# EAGLE design Flyfocus_Bird_CANdy_V1.0 (EAGLE 9.6.2)

## Sheet 1 of 3: Microcontroller
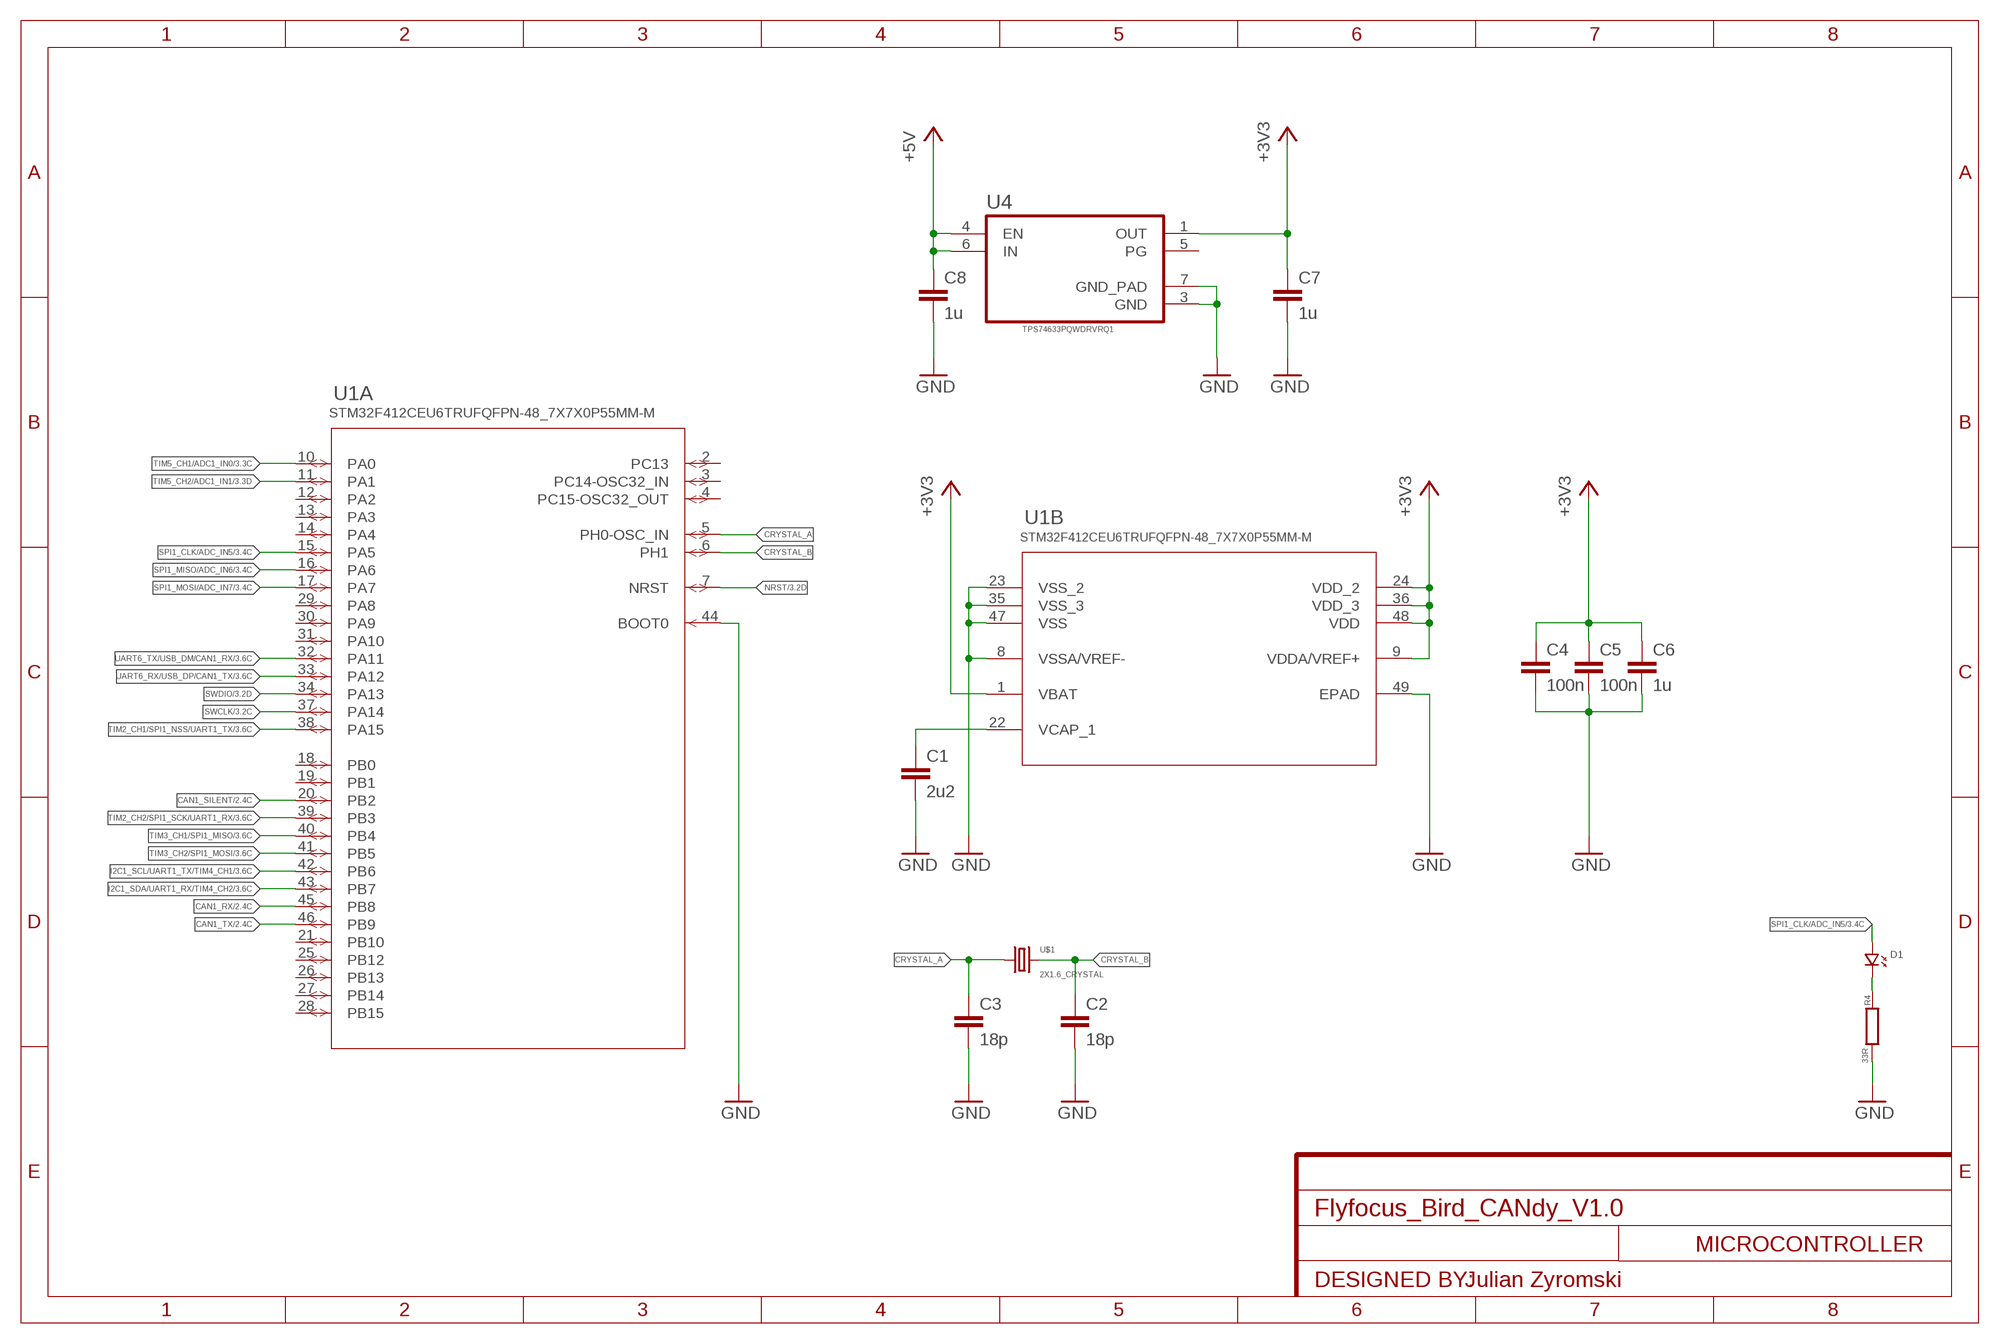
[diagram p0: schematic, sheet 1]

### Parts
C1  2u2  C-EUC0402_RESISTOR_FOOTPRINT  [R0402]
C2  18p  C-EUC0402_RESISTOR_FOOTPRINT  [R0402]
C3  18p  C-EUC0402_RESISTOR_FOOTPRINT  [R0402]
C4  100n  C-EUC0402_RESISTOR_FOOTPRINT  [R0402]
C5  100n  C-EUC0402_RESISTOR_FOOTPRINT  [R0402]
C6  1u  C-EUC0402_RESISTOR_FOOTPRINT  [R0402]
C7  1u  C-EUC0402_RESISTOR_FOOTPRINT  [R0402]
C8  1u  C-EUC0402_RESISTOR_FOOTPRINT  [R0402]
D1  LED.0402  [0402.LED]
R4  33R  R-EU_R0402  [R0402]
U1  STM32F412CEU6TRUFQFPN-48_7X7X0P55MM-M  [UFQFPN-48_7X7X0P55MM-M]
U4  TPS74633PQWDRVRQ1  [SON65P200X200X80-7N]
U$1  2X1.6_CRYSTAL  [OSC_FA-128_16MHZ]

### Nets
+3V3: C4.1 C5.1 C6.1 C7.1 U1.1(B:VBAT) U1.9(B:VDDA/VREF+) U1.24(B:VDD_2) U1.36(B:VDD_3) U1.48(B:VDD) U4.1(OUT) ; also sheet 2,3
+5V: C8.1 U4.4(EN) U4.6(IN) ; also sheet 2,3
CAN1_RX: U1.45(A:PB8) ; also sheet 2
CAN1_SILENT: U1.20(A:PB2) ; also sheet 2
CAN1_TX: U1.46(A:PB9) ; also sheet 2
CRYSTAL_A: C3.1 U1.5(A:PH0-OSC_IN) U$1.1
CRYSTAL_B: C2.1 U1.6(A:PH1) U$1.3
GND: C1.2 C2.2 C3.2 C4.2 C5.2 C6.2 C7.2 C8.2 R4.2 U1.8(B:VSSA/VREF-) U1.23(B:VSS_2) U1.35(B:VSS_3) U1.44(A:BOOT0) U1.47(B:VSS) U1.49(B:EPAD) U4.3(GND) U4.7(GND_PAD) ; also sheet 2,3
I2C1_SCL/UART1_TX/TIM4_CH1: U1.42(A:PB6) ; also sheet 3
I2C1_SDA/UART1_RX/TIM4_CH2: U1.43(A:PB7) ; also sheet 3
N$1: C1.1 U1.22(B:VCAP_1)
N$4: D1.P$2 R4.1
NRST: U1.7(A:NRST) ; also sheet 3
SPI1_CLK/ADC_IN5: D1.P$1 U1.15(A:PA5) ; also sheet 3
SPI1_MISO/ADC_IN6: U1.16(A:PA6) ; also sheet 3
SPI1_MOSI/ADC_IN7: U1.17(A:PA7) ; also sheet 3
SWCLK: U1.37(A:PA14) ; also sheet 3
SWDIO: U1.34(A:PA13) ; also sheet 3
TIM2_CH1/SPI1_NSS/UART1_TX: U1.38(A:PA15) ; also sheet 3
TIM2_CH2/SPI1_SCK/UART1_RX: U1.39(A:PB3) ; also sheet 3
TIM3_CH1/SPI1_MISO: U1.40(A:PB4) ; also sheet 3
TIM3_CH2/SPI1_MOSI: U1.41(A:PB5) ; also sheet 3
TIM5_CH1/ADC1_IN0: U1.10(A:PA0) ; also sheet 3
TIM5_CH2/ADC1_IN1: U1.11(A:PA1) ; also sheet 3
UART6_RX/USB_DP/CAN1_TX: U1.33(A:PA12) ; also sheet 3
UART6_TX/USB_DM/CAN1_RX: U1.32(A:PA11) ; also sheet 3
Unconnected: U1.2(A:PC13) U1.3(A:PC14-OSC32_IN) U1.4(A:PC15-OSC32_OUT) U1.12(A:PA2) U1.13(A:PA3) U1.14(A:PA4) U1.18(A:PB0) U1.19(A:PB1) U1.21(A:PB10) U1.25(A:PB12) U1.26(A:PB13) U1.27(A:PB14) U1.28(A:PB15) U1.29(A:PA8) U1.30(A:PA9) U1.31(A:PA10) U4.5(PG)

### Notes on the sheet
- MICROCONTROLLER
- Julian Zyromski

## Sheet 2 of 3: CAN Interface
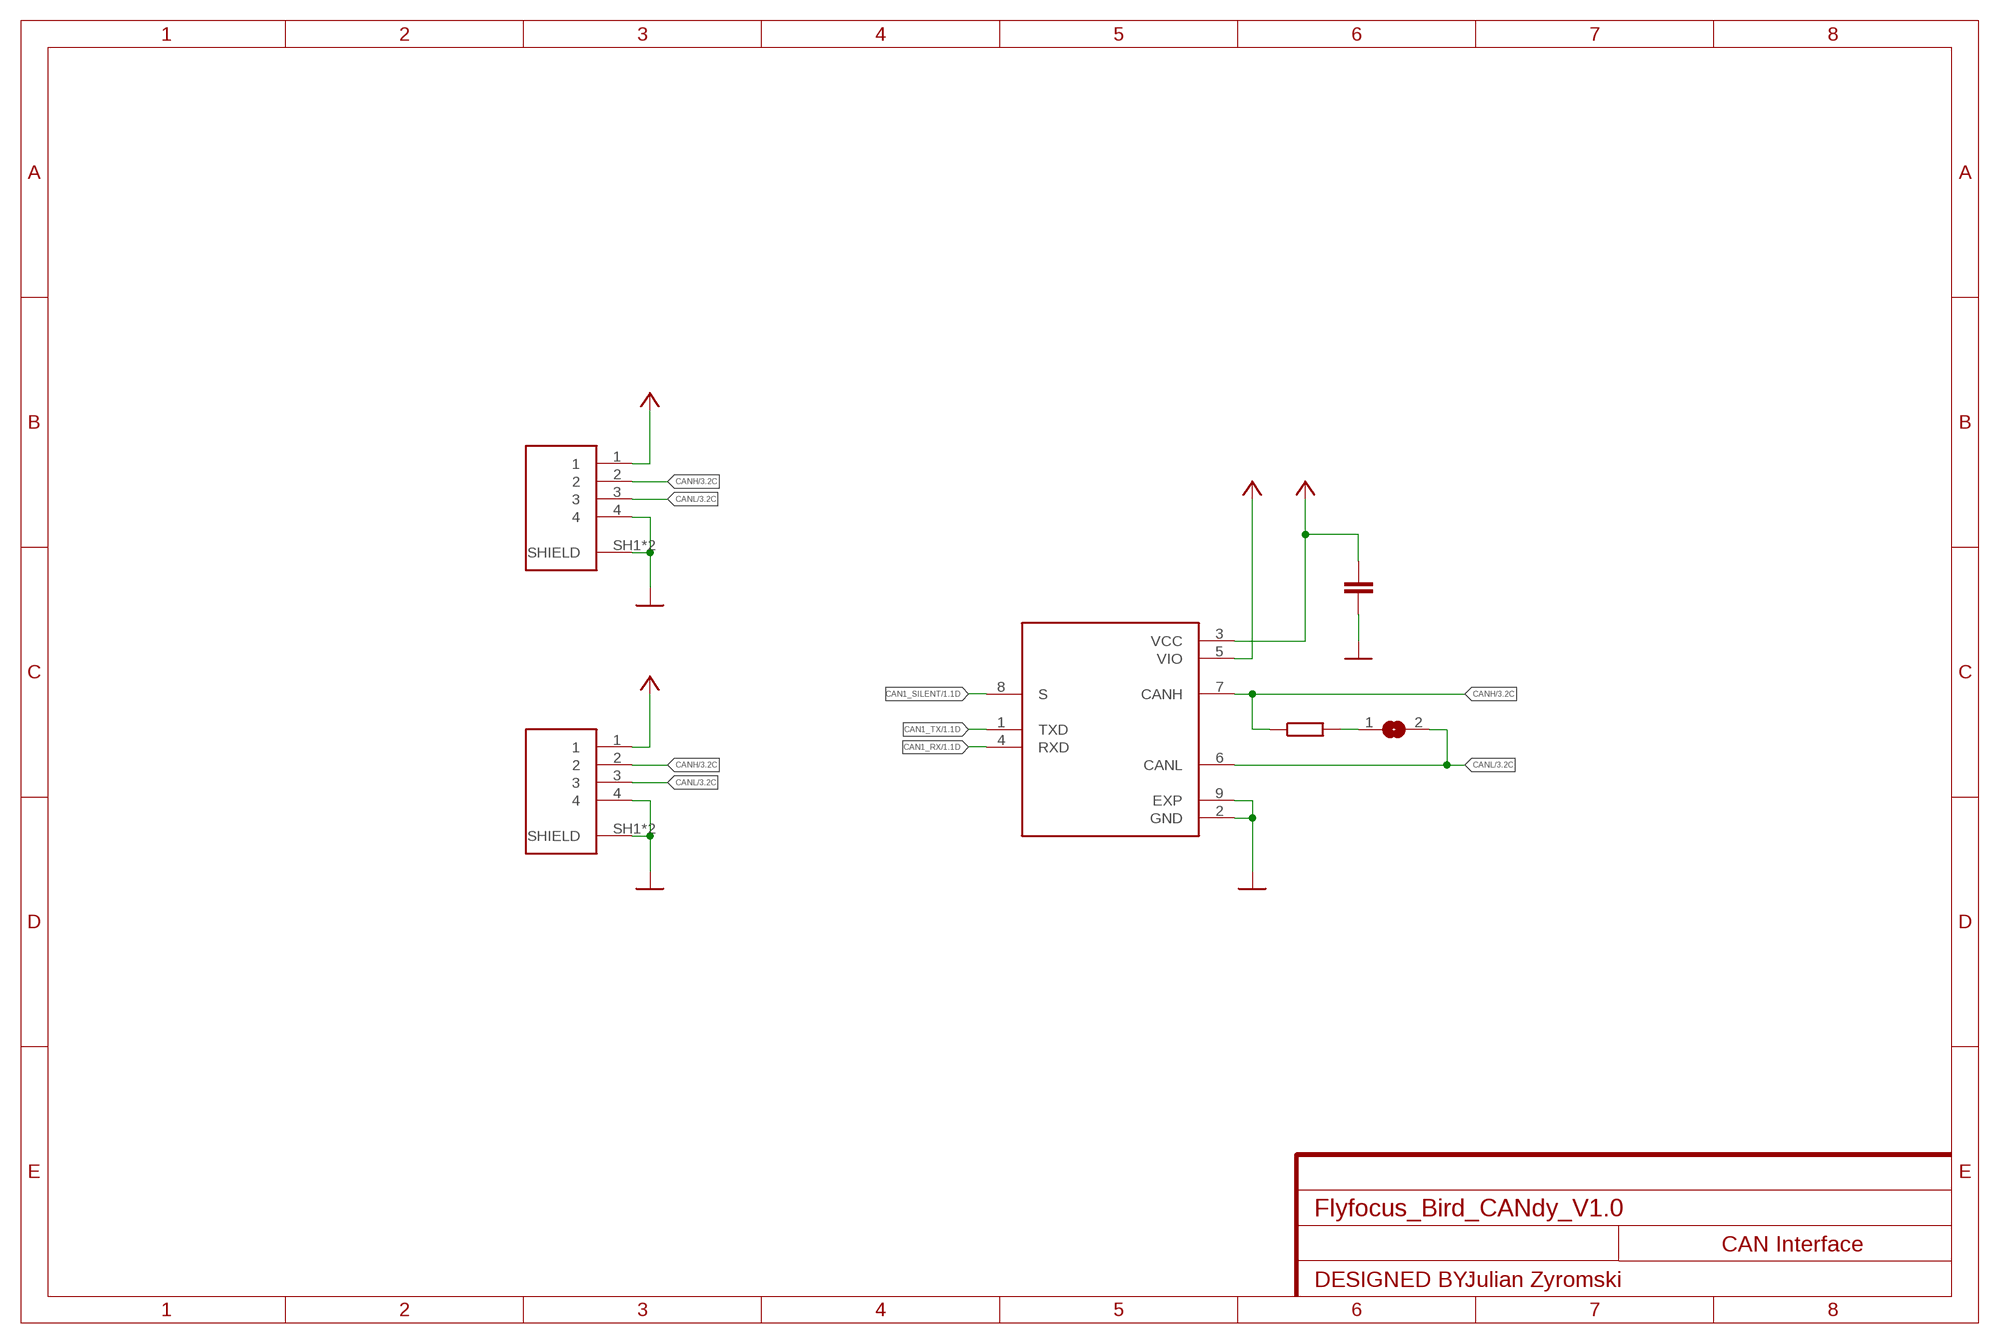
[diagram p1: schematic, sheet 2]

### Parts
C9  2u2  C-EUC0402_RESISTOR_FOOTPRINT  [R0402]
J1  SM04B-GHS-TB(LF)(SN)-  [JST_SM04B-GHS-TB(LF)(SN)-]
J2  SM04B-GHS-TB(LF)(SN)-  [JST_SM04B-GHS-TB(LF)(SN)-]
R1  120R/thick_film  R0603  [0603]
SJ1  SJ  [SJ]
U2  TJA1051TK/3/1J  [SON65P300X300X95-8N]

### Nets
+3V3: U2.5(VIO) ; also sheet 1,3
+5V: C9.1 J1.1 J2.1 U2.3(VCC) ; also sheet 1,3
CAN1_RX: U2.4(RXD) ; also sheet 1
CAN1_SILENT: U2.8(S) ; also sheet 1
CAN1_TX: U2.1(TXD) ; also sheet 1
CANH: J1.2 J2.2 R1.P$1 U2.7(CANH) ; also sheet 3
CANL: J1.3 J2.3 SJ1.2 U2.6(CANL) ; also sheet 3
GND: C9.2 J1.4 J1.SH1(SHIELD) J1.SH2(SHIELD) J2.4 J2.SH1(SHIELD) J2.SH2(SHIELD) U2.2(GND) U2.9(EXP) ; also sheet 1,3
N$3: R1.P$2 SJ1.1

### Notes on the sheet
- CAN Interface
- Julian Zyromski

## Sheet 3 of 3: GPIO
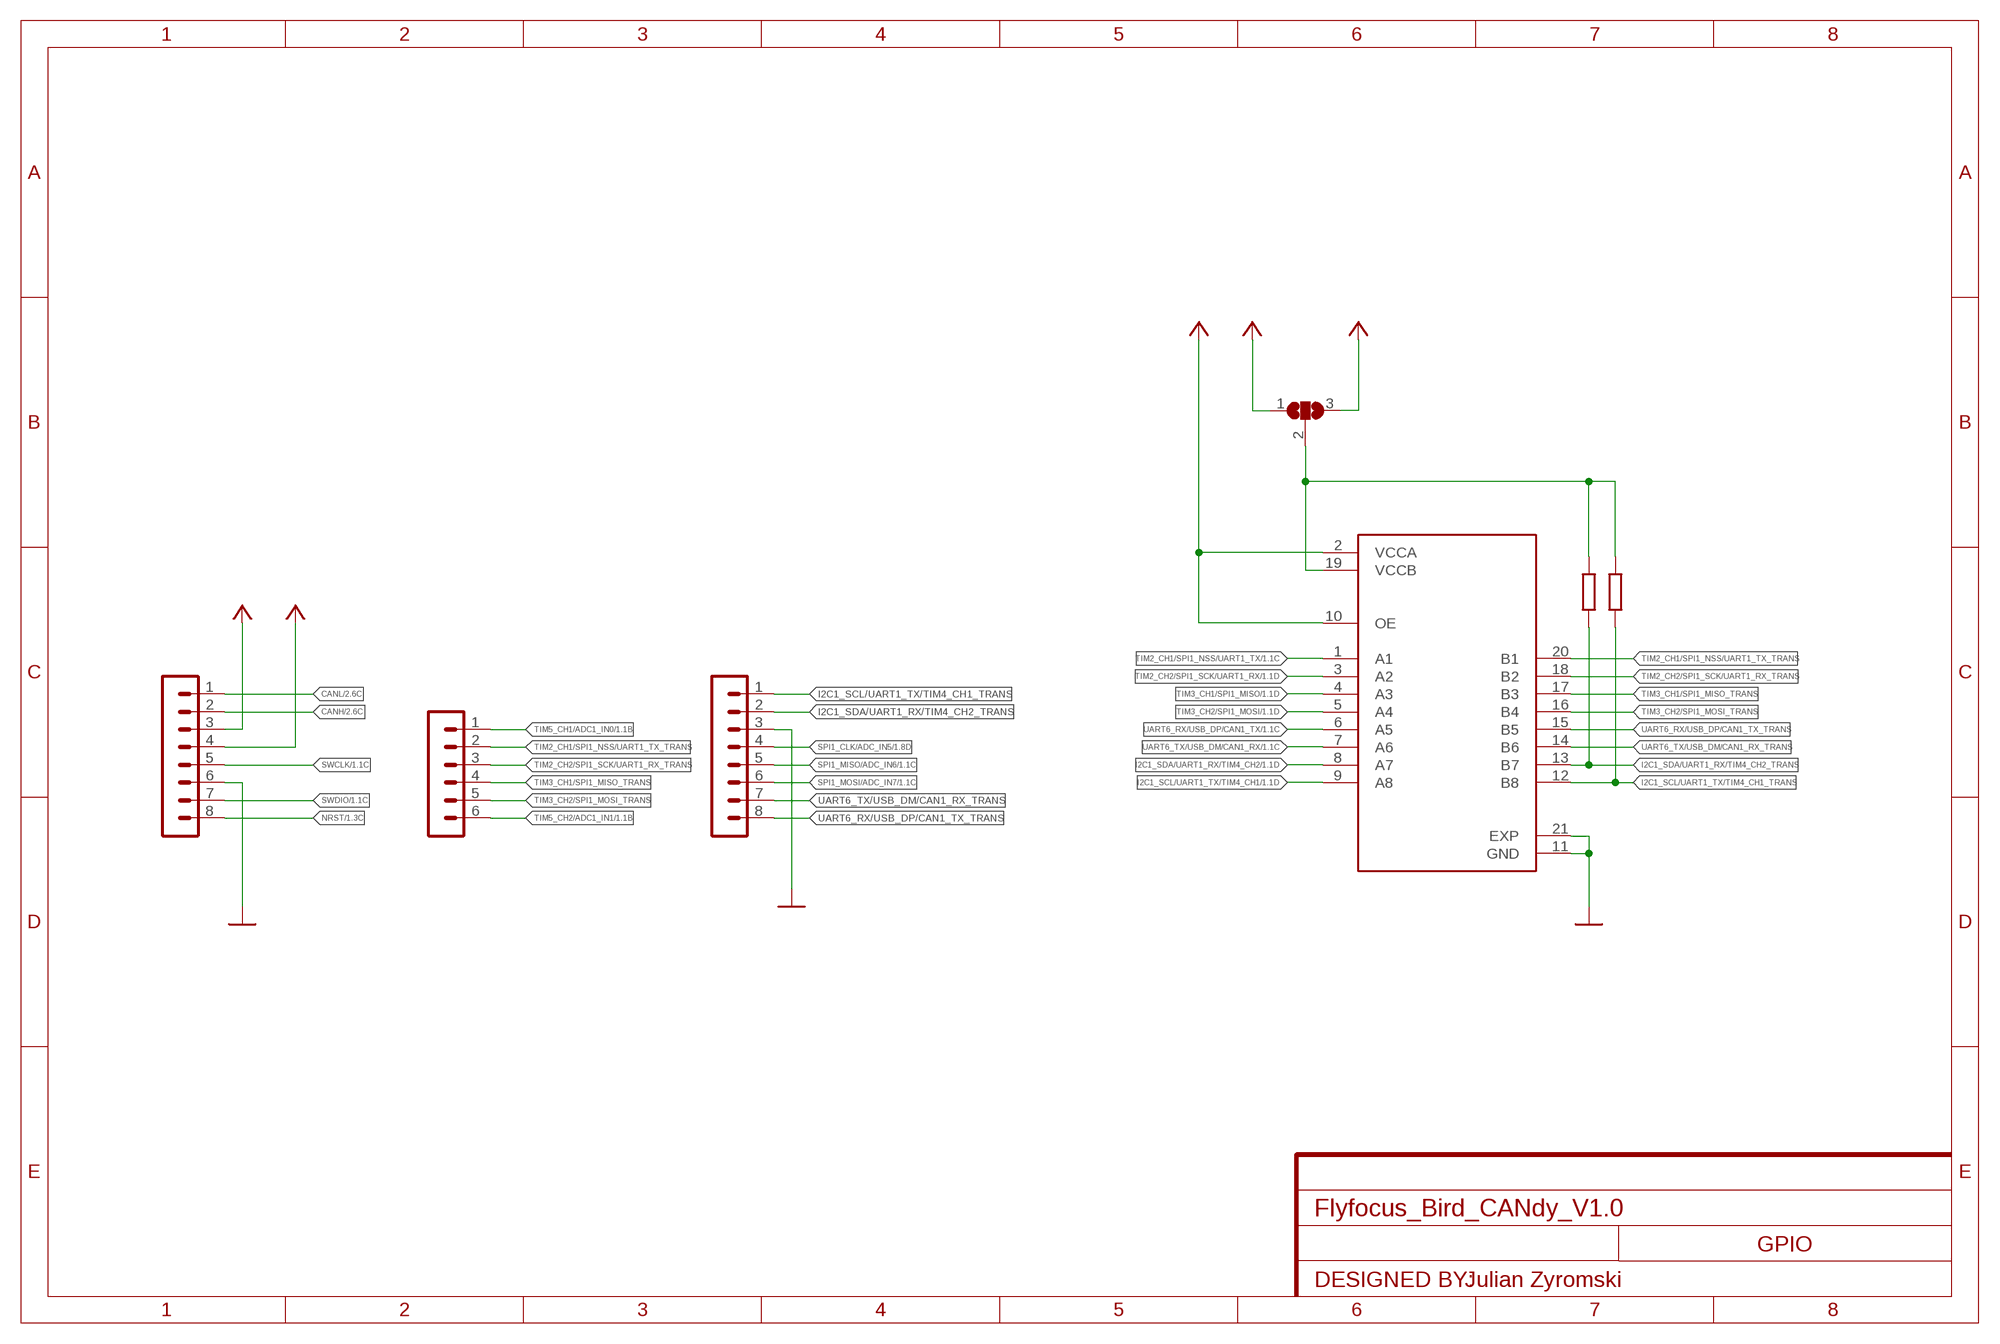
[diagram p2: schematic, sheet 3]

### Parts
R2  4k7  R-EU_R0402  [R0402]
R3  4k7  R-EU_R0402  [R0402]
SJ2  SJ2W  [SJ_2]
SV1  MA08-1  [MA08-1]
SV2  MA08-1  [MA08-1]
SV3  MA06-1  [MA06-1]
U3  TXS0108ERGYR  [IC_TXS0108ERGYR]

### Nets
+3V3: SJ2.1 SV1.4 U3.2(VCCA) U3.10(OE) ; also sheet 1,2
+5V: SJ2.3 SV1.3 ; also sheet 1,2
CANH: SV1.2 ; also sheet 2
CANL: SV1.1 ; also sheet 2
GND: SV1.6 SV2.3 U3.11(GND) U3.21(EXP) ; also sheet 1,2
I2C1_SCL/UART1_TX/TIM4_CH1: U3.9(A8) ; also sheet 1
I2C1_SCL/UART1_TX/TIM4_CH1_TRANS: R3.1 SV2.1 U3.12(B8)
I2C1_SDA/UART1_RX/TIM4_CH2: U3.8(A7) ; also sheet 1
I2C1_SDA/UART1_RX/TIM4_CH2_TRANS: R2.1 SV2.2 U3.13(B7)
N$2: R2.2 R3.2 SJ2.2 U3.19(VCCB)
NRST: SV1.8 ; also sheet 1
SPI1_CLK/ADC_IN5: SV2.4 ; also sheet 1
SPI1_MISO/ADC_IN6: SV2.5 ; also sheet 1
SPI1_MOSI/ADC_IN7: SV2.6 ; also sheet 1
SWCLK: SV1.5 ; also sheet 1
SWDIO: SV1.7 ; also sheet 1
TIM2_CH1/SPI1_NSS/UART1_TX: U3.1(A1) ; also sheet 1
TIM2_CH1/SPI1_NSS/UART1_TX_TRANS: SV3.2 U3.20(B1)
TIM2_CH2/SPI1_SCK/UART1_RX: U3.3(A2) ; also sheet 1
TIM2_CH2/SPI1_SCK/UART1_RX_TRANS: SV3.3 U3.18(B2)
TIM3_CH1/SPI1_MISO: U3.4(A3) ; also sheet 1
TIM3_CH1/SPI1_MISO_TRANS: SV3.4 U3.17(B3)
TIM3_CH2/SPI1_MOSI: U3.5(A4) ; also sheet 1
TIM3_CH2/SPI1_MOSI_TRANS: SV3.5 U3.16(B4)
TIM5_CH1/ADC1_IN0: SV3.1 ; also sheet 1
TIM5_CH2/ADC1_IN1: SV3.6 ; also sheet 1
UART6_RX/USB_DP/CAN1_TX: U3.6(A5) ; also sheet 1
UART6_RX/USB_DP/CAN1_TX_TRANS: SV2.8 U3.15(B5)
UART6_TX/USB_DM/CAN1_RX: U3.7(A6) ; also sheet 1
UART6_TX/USB_DM/CAN1_RX_TRANS: SV2.7 U3.14(B6)

### Notes on the sheet
- GPIO
- Julian Zyromski

## Library data of the parts
C1-C9 = rcl_julian:C-EU: CAPACITOR, European symbol
D1 = standardparts:LED
J1 J2 = SM04B-GHS-TB_LF__SN_-:SM04B-GHS-TB(LF)(SN)-: Conn Header Gh Side 4pos 1.25mm; AVAILABILITY: Unavailable; DESCRIPTION: Conn Header Gh Side 4pos 1.25mm; MF: JST Sales; MP: SM04B-GHS-TB_LF__SN_-; PACKAGE: None; PRICE: None
R1 = sapog_reference_hardware:R
R2-R4 = rcl_julian:R-EU_: RESISTOR, European symbol; SPICEPREFIX: R
SJ1 = jumper:SJ: SMD solder JUMPER
SJ2 = jumper:SJ2W: SMD solder JUMPER
SV1 SV2 = con-lstb:MA08-1: PIN HEADER; OC_FARNELL: unknown; OC_NEWARK: unknown
SV3 = con-lstb:MA06-1: PIN HEADER; OC_FARNELL: unknown; OC_NEWARK: unknown
U1 = STM32F412CEU6:STM32F412CEU6TR; BUILT_BY: EMA_UL_Team; COPYRIGHT: Copyright (C) 2018 Accelerated Designs. All rights reserved; MANUFACTURER_PART_NUMBER: STM32F412CEU6TR; SOURCELIBRARY: STMicroelectronics_2020-10-07; VENDOR: STMicroelectronics
U2 = TJA1051TK_3_1J:TJA1051TK/3/1J: TJA1051 Single 5 V 1 MBd Surface Mount High Speed CAN Transceiver - HVSON-8; AVAILABILITY: Unavailable; DESCRIPTION: TJA1051 Single 5 V 1 MBd Surface Mount High Speed CAN Transceiver - HVSON-8; MF: NXP USA; MP: TJA1051TK/3/1J; PACKAGE: VDFN-8 NXP Semiconductors; PRICE: None
U3 = TXS0108ERGYR:TXS0108ERGYR: 8-bit bidirectional voltage-level shifter for open-drain and push-pull application 20-VQFN -40 to 85 Check prices <https://pricing.snapeda.com/search/part/TXS0108ERGYR/?ref=eda>; AVAILABILITY: Good; DESCRIPTION: 8-bit bidirectional voltage-level shifter for open-drain and push-pull application 20-VQFN -40 to 85; MF: Texas Instruments; MP: TXS0108ERGYR; PACKAGE: VQFN-20 Texas Instruments; PRICE: None; PURCHASE-URL: https://pricing.snapeda.com/search/part/TXS0108ERGYR/?ref=eda
U4 = TPS74633PQWDRVRQ1:TPS74633PQWDRVRQ1: None Check prices <https://pricing.snapeda.com/parts/TPS74633PQWDRVRQ1/Texas%20Instruments/view-part?ref=eda>; AVAILABILITY: Warning; DESCRIPTION: Automotive 1-A, low-IQ, high-PSRR, low-dropout (LDO) voltage regulator with power good 6-WSON -40 to 125; MF: Texas Instruments; MP: TPS74633PQWDRVRQ1; PACKAGE: WSON-6 Texas Instruments; PRICE: None; PURCHASE-URL: https://pricing.snapeda.com/search/part/TPS74633PQWDRVRQ1/?ref=eda
U$1 = OSC_FA-128_16MHz:2X1.6_CRYSTAL

## Board
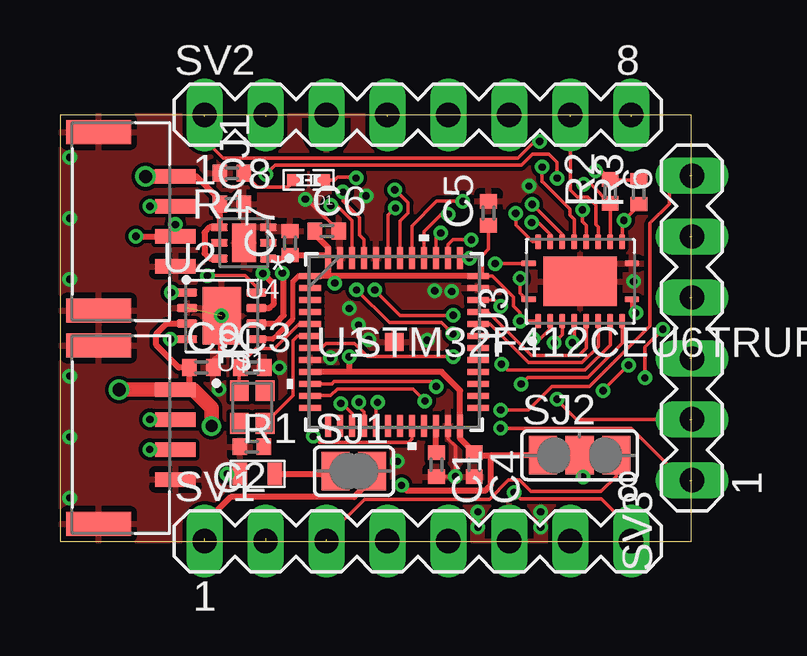
[diagram p3: board, top side]
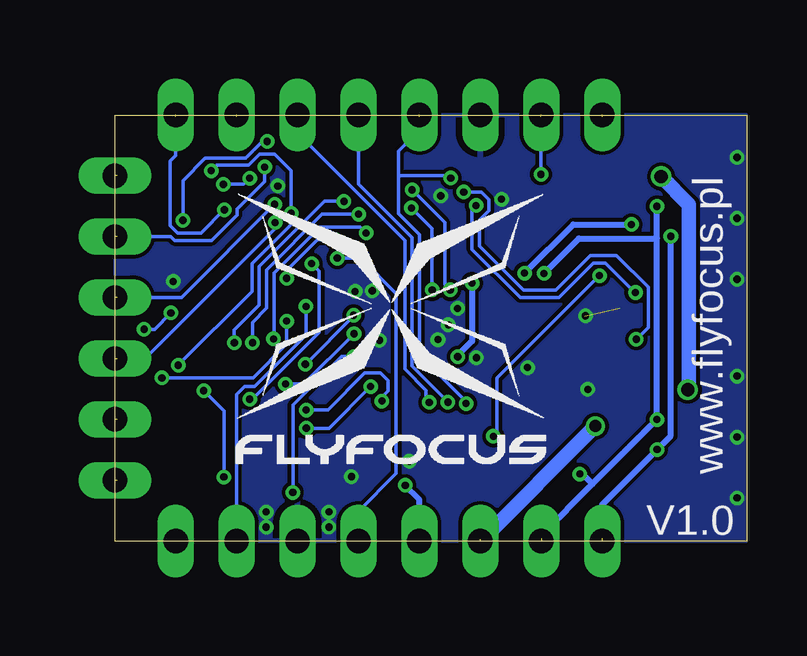
[diagram p4: board, bottom side, seen from below]

Size 26.33 x 17.77 mm. Coordinates in mm from the lower left corner, seen from the top.
Outline: 0,0 26.33,0 26.33,17.77 0,17.77 0,0
Copper layers (1*16): Top 0.035mm / dielectric 0.8mm / Bottom 0.035mm
Design rules "default *": minimum track width 6mil, minimum drill 0.3mm, track to track 6mil, track to pad 6mil, pad to pad 6mil, via to via 6mil, smd to smd 6mil, copper to edge 0mil, drill to drill 6mil, minimum pad ring 6mil, minimum via ring 6mil, stop-mask expansion 4mil, vias tented up to drill 40mil, thermal gap 10mil

### Footprints (pad centres in the part's own frame; a part is rotated, then mirrored left to right if it is on the bottom)
R0402 = smd 0.6 x 0.7: 1 -0.5,0; 2 0.5,0
0402.LED = smd 0.7 x 0.5: P$1 -0.55,0; P$2 0.55,0
JST_SM04B-GHS-TB(LF)(SN)- = smd 0.6 x 1.7: 1 -1.875,2.275; 2 -0.625,2.275; 3 0.625,2.275; 4 1.875,2.275 | smd 1 x 2.7: SH1 -3.725,-0.925; SH2 3.725,-0.925
0603 = smd 0.6 x 0.9: P$1 -0.725,0; P$2 0.725,0
SJ = smd 1.168 x 1.6: 1 -0.762,0; 2 0.762,0
SJ_2 = smd 1.168 x 1.6: 1 -1.524,0; 2 0,0; 3 1.524,0
MA08-1 = drill 1.016 long: 1 -8.89,0; 2 -6.35,0; 3 -3.81,0; 4 -1.27,0; 5 1.27,0; 6 3.81,0; 7 6.35,0; 8 8.89,0
MA06-1 = drill 1.016 long: 1 -6.35,0; 2 -3.81,0; 3 -1.27,0; 4 1.27,0; 5 3.81,0; 6 6.35,0
UFQFPN-48_7X7X0P55MM-M = smd 0.914 x 0.254: 1 -3.505,2.75; 2 -3.505,2.25; 3 -3.505,1.75; 4 -3.505,1.25; 5 -3.505,0.75; 6 -3.505,0.25; 7 -3.505,-0.25; 8 -3.505,-0.75; 9 -3.505,-1.25; 10 -3.505,-1.75; 11 -3.505,-2.25; 12 -3.505,-2.75; 25 3.505,-2.75; 26 3.505,-2.25; 27 3.505,-1.75; 28 3.505,-1.25; 29 3.505,-0.75; 30 3.505,-0.25; 31 3.505,0.25; 32 3.505,0.75; 33 3.505,1.25; 34 3.505,1.75; 35 3.505,2.25; 36 3.505,2.75 | smd 0.254 x 0.914: 13 -2.75,-3.505; 14 -2.25,-3.505; 15 -1.75,-3.505; 16 -1.25,-3.505; 17 -0.75,-3.505; 18 -0.25,-3.505; 19 0.25,-3.505; 20 0.75,-3.505; 21 1.25,-3.505; 22 1.75,-3.505; 23 2.25,-3.505; 24 2.75,-3.505; 37 2.75,3.505; 38 2.25,3.505; 39 1.75,3.505; 40 1.25,3.505; 41 0.75,3.505; 42 0.25,3.505; 43 -0.25,3.505; 44 -0.75,3.505; 45 -1.25,3.505; 46 -1.75,3.505; 47 -2.25,3.505; 48 -2.75,3.505 | smd 0.762 x 0.762: 49 0,0
SON65P300X300X95-8N = smd 0.84 x 0.32: 1 -1.445,0.975; 2 -1.445,0.325; 3 -1.445,-0.325; 4 -1.445,-0.975; 5 1.445,-0.975; 6 1.445,-0.325; 7 1.445,0.325; 8 1.445,0.975 | smd 1.6 x 2.4: 9 0,0
IC_TXS0108ERGYR = smd 0.24 x 0.6: 1 -0.75,2.15; 10 -0.75,-2.15; 11 0.75,-2.15; 20 0.75,2.15 | smd 0.6 x 0.24: 2 -1.65,1.75; 3 -1.65,1.25; 4 -1.65,0.75; 5 -1.65,0.25; 6 -1.65,-0.25; 7 -1.65,-0.75; 8 -1.65,-1.25; 9 -1.65,-1.75; 12 1.65,-1.75; 13 1.65,-1.25; 14 1.65,-0.75; 15 1.65,-0.25; 16 1.65,0.25; 17 1.65,0.75; 18 1.65,1.25; 19 1.65,1.75 | smd 2.05 x 3.05: 21 0,0
SON65P200X200X80-7N = smd 0.69 x 0.32: 1 -1.02,0.65; 2 -1.02,0; 3 -1.02,-0.65; 4 1.02,-0.65; 5 1.02,0; 6 1.02,0.65 | smd 1 x 1.6: 7 0,0
OSC_FA-128_16MHZ = smd 0.774 x 0.874: 1 -0.537,0.687; 2 -0.537,-0.687; 3 0.537,-0.687; 4 0.537,0.687

### Placement (x,y rotation side)
C1  15.7,3.19 270 top
C2  8,3.94 180 top
C3  8.01,7.24 0 top
C4  17.27,3.19 270 top
C5  17.87,13.68 90 top
C6  11.13,12.93 0 top
C7  9.6,12.43 90 top
C8  7.17,14.06 0 top
C9  5.89,7.24 0 top
D1  10.36,15.06 180 top
J1  2.54,13.34 270 top
J2  2.54,4.45 270 top
R1  8.23,2.81 0 top
R2  22.94,14.58 90 top
R3  24.13,14.55 90 top
R4  7.16,15.34 180 top
SJ1  12.26,2.92 0 top
SJ2  21.67,3.58 0 top
SV1  14.92,0 0 top
SV2  14.92,17.78 0 top
SV3  26.35,8.89 90 top
U1  13.93,8.31 0 top
U2  6.74,9.4 0 top
U3  21.69,10.83 90 top
U4  7.67,12.44 180 top
U$1  8.01,5.59 0 top

### Tracks (layer width: path | path; a pad name or v marks a point on that pad's centre or on a via)
+3V3  (via drill 0.3)
  Top 0.152: 17.61,11.11 17.55,11.06 U1.36 | 17.61,11.11 17.61,11.92 17.87,12.18 C5.1 | U3.2 v19.19,9.18 v19.18,9.18 19.18,9.53 18.91,9.81 18.91,10.18 18.04,11.05 17.67,11.05 17.61,11.11 | v24.39,6.81 24.39,8.09 v25.13,8.84 | v24.02,9.52 23.84,9.7 U3.10
  Top 0.203: U2.5 8.87,8.42 9.09,8.64 9.71,9.26 9.71,10.83 9.94,11.06 U1.1
  Top 0.254: U4.1 9.45,11.79 C7.1 11.16,11.93 11.18,11.91 | 11.18,11.91 U1.48 11.18,11.07 11.17,11.06 | C6.1 10.63,12.78 11.18,12.23 11.18,11.91 | U1.36 11.42,11.06 | 11.42,11.06 11.17,11.06 | 11.17,11.06 U1.1 | v11.46,10.76 11.46,11.02 11.42,11.06 | 12.09,7.06 15.91,7.06 16.68,6.28 U1.24 16.68,4.28 C4.1 17.38,3.58 17.98,3.58 | SJ2.1 17.98,3.58 | v14.24,2.33 14.46,2.11 17.74,2.11 17.98,2.35 17.98,3.58 | 12.09,7.06 U1.9 | v12.06,7.69 12.06,7.09 12.09,7.06
  Bottom 0.152: v19.18,9.18 19.18,8.22 20.59,6.81 v24.39,6.81 | v25.13,8.84 24.7,8.84 v24.02,9.52
  Bottom 0.254: v11.46,10.76 11.46,8.34 12.06,7.74 v12.06,7.69 | SV1.4 13.65,1.74 v14.24,2.33
+5V  (via drill 0.5, 0.55)  (1 unrouted)
  Top 0.152: SJ2.3 23.19,2.7 22.55,2.07 19.64,2.07 19.15,2.56 18.71,2.56 17.9,1.75 12.69,1.75 11.11,0.17 11.11,0.08
  Top 0.254: U4.6 6.25,11.79 6.02,12.01 6.02,12.86 6.25,13.09 U4.4 6.66,13.11 C8.1 6.66,14.24 5.7,15.2 J1.1 | U2.3 4.44,9.07 4.02,8.65 4.02,8.18 4.95,7.24 C9.1 5.39,6.45 5.27,6.32
  Top 0.61: v2.46,6.32 | v3.57,15.2 J1.1 | v6.32,4.8 6.32,5.57 5.56,6.32 5.27,6.32 J2.1 v2.46,6.32
  Bottom 0.61: v2.46,6.32 2.41,6.37 2.41,14.04 v3.57,15.2 | SV1.3 v6.32,4.8
CAN1_RX  (via drill 0.3)
  Top 0.152: U1.45 12.68,12.57 12.49,12.76 12.49,13.5 11.8,14.18 v11.8,14.56 | v4.61,8.42 U2.4
  Bottom 0.152: v4.61,8.42 4.11,8.92 4.11,10.59 5.43,11.91 6.51,11.91 7.06,11.37 | 7.06,11.37 | 7.06,11.37 7.96,10.47 9.31,10.47 11.15,12.3 11.15,13.38 10.76,13.78 10.76,14.25 11.06,14.56 v11.8,14.56
CAN1_SILENT  (via drill 0.3)
  Top 0.152: U2.8 8.19,10.59 7.71,11.07 v6.15,11.07 v6.14,11.07 | U1.20 14.68,4.27 14.53,4.12 10.82,4.12 v10.57,4.37
  Bottom 0.152: v6.14,11.07 10.41,6.8 10.41,4.52 v10.57,4.37
CAN1_TX  (via drill 0.3)
  Top 0.152: U1.46 12.18,13.37 11.56,14 v11.29,14 | v4.64,10.37 v4.65,10.37 U2.1
  Bottom 0.152: v4.64,10.37 4.66,10.37 5.9,11.61 6.39,11.61 7.83,10.16 9.45,10.16 11.45,12.17 11.45,13.83 v11.29,14
CANH  (via drill 0.3)  (1 unrouted)
  Top 0.254: J2.2 v3.75,5.07 | v3.75,13.96 J1.2 | U2.7 8.75,9.72 8.92,9.9 8.92,10.7 v8.46,11.16 | R1.P$1 v6.97,2.81 v6.96,2.8
  Bottom 0.254: 3.75,12.62 v3.75,5.07 6.44,2.39 | 3.75,12.62 v3.75,13.96 | 6.44,2.39 8.57,0.25 8.57,0.13 | v8.46,11.16 7,12.62 3.75,12.62 | v6.96,2.8 6.85,2.8 6.44,2.39
CANL  (via drill 0.3)  (1 unrouted)
  Top 0.254: J2.3 v3.74,3.82 | v3.17,12.71 4.8,12.71 | 4.8,12.71 J1.3 | J1.3 | SJ1.2 13.02,2.59 12.27,1.84 7.12,1.84 6.03,0.75 SV1.1 | U2.6 8.98,9.07 9.33,9.42 9.33,11.11 v9.27,11.18 | v4.81,13.21 4.81,12.72 4.8,12.71
  Bottom 0.254: v3.17,12.71 3.17,4.39 v3.74,3.82 6.03,1.53 6.03,0.13 | v9.27,11.18 7.24,13.21 v4.81,13.21
CRYSTAL_A
  Top 0.152: U$1.1 7.48,7.2 C3.1 7.51,7.37 8.18,8.03 8.95,8.03 9.97,9.06 U1.5
CRYSTAL_B
  Top 0.152: C2.1 8.55,3.99 U$1.3 9.72,6.07 9.72,8.37 9.9,8.56 U1.6
GND  (via drill 0.3)  (1 unrouted)
  Top 0.152: U1.23 16.18,4.27 16.48,3.96 v16.48,2.69 C1.2 | C6.2 11.1,13.46 11.07,13.46 10.27,14.26 v10.23,14.26
  Top 0.305: C9.2 6.39,7.44 6.74,7.79 U2.9
  other vias: 6.73,9.4 0.41,1.8 0.41,4.34 0.41,6.88 0.41,16 0.41,13.46 0.41,10.92 12.88,8.41 12.06,9.7 12.45,9.02 6.63,6.33 11.28,7.65 9.14,7.24 16.33,10.41 15.62,10.44 15.32,8.38 17.42,0.58 17.42,1.22 20.04,1.22 20.04,0.58 14.07,3.33 12.76,14.4 23.92,10.83 19.56,14.81
  pour Bottom: 0.03,17.78 26.34,17.78 26.34,0 0.03,0
  pour Top: 0.03,17.78 26.34,17.78 26.34,0 0.03,0
I2C1_SCL/UART1_TX/TIM4_CH1  (via drill 0.3)
  Top 0.152: U3.9 23.44,8.25 22.01,6.83 19.5,6.83 v19.23,6.55 | v16.38,8.65 15.91,9.12 13.73,9.12 v12.37,10.47 v12.36,10.47 | U1.42 14.18,13.34 14.52,13.67 14.52,14.11 13.98,14.65 v13.96,14.65
  Bottom 0.152: v16.38,8.65 v16.39,8.65 18.48,6.55 v19.23,6.55 | v12.36,10.47 12.59,10.7 12.59,13.28 v13.96,14.65
I2C1_SCL/UART1_TX/TIM4_CH1_TRANS  (via drill 0.3)  (1 unrouted)
  Top 0.152: 6.03,17.69 6.03,16.75 6.8,15.98 19.1,15.98 19.79,16.67 v20,16.67 | v23.51,13.38 23.44,13.3 U3.12 | R3.1 24.13,13.99 v23.51,13.38 | v23.51,13.38
  Bottom 0.152: v23.51,13.38 23.51,15.04 22.58,15.98 20.91,15.98 20.22,16.67 v20,16.67
I2C1_SDA/UART1_RX/TIM4_CH2  (via drill 0.3)
  Top 0.152: U3.8 22.94,8.19 21.89,7.14 18.65,7.14 v18.41,7.38 | v16.39,9.42 14.18,9.42 v13.12,10.47 | v13.98,13.89 13.68,13.59 U1.43
  Bottom 0.152: v16.39,9.42 16.39,9.39 v18.41,7.38 | v13.12,10.47 13.12,13.03 v13.98,13.89
I2C1_SDA/UART1_RX/TIM4_CH2_TRANS  (via drill 0.3)  (1 unrouted)
  Top 0.152: U3.13 R2.1 22.13,14.88 v21.83,14.88 | v20.73,15.13 20.73,15.8 20.39,16.14 19.69,16.14 19.23,15.68 8.96,15.68 v8.58,15.3
  Bottom 0.152: v21.83,14.88 20.98,14.88 v20.73,15.13 | v8.58,15.3 8.58,17.69
N$1
  Top 0.254: C1.1 15.68,3.7 U1.22
N$2  (via drill 0.3)
  Top 0.152: U3.19 19.7,12.48 19,13.19 v19,13.67 | v22.33,15.45 22.57,15.45 R2.2 22.96,15.05 R3.2 | SJ2.2 21.67,2.81 v21.8,2.68 | v22.65,6.28 v23.71,7.34
  Bottom 0.152: v21.8,2.68 21.8,5.43 v22.65,6.28 | v22.33,15.45 22.1,15.67 20.78,15.67 20.33,16.13 19.69,16.13 19,15.44 v19,13.67 19,13.2 20.63,11.57 20.63,10.41 v23.71,7.34 | v22.33,15.45
N$3
  Top 0.254: R1.P$2 11.38,2.81 SJ1.1
N$4
  Top 0.152: D1.P$2 9.52,14.77 8.24,14.77 R4.1
NRST  (via drill 0.3)
  Top 0.152: SV1.8 23.81,0.52 22.57,1.76 19.2,1.76 v18.93,2.03 | U1.7 10.91,8.06 11.09,8.23 12.29,8.23 12.83,7.7 v16.39,7.7
  Bottom 0.152: v18.93,2.03 18.93,5.67 16.9,7.7 v16.39,7.7
SPI1_CLK/ADC_IN5  (via drill 0.3)  (1 unrouted)
  Top 0.152: v11.71,5.74 11.76,5.74 12.18,5.32 U1.15 | D1.P$1 11.45,15.06 11.58,15.19 12.3,15.19 v12.34,15.15
  Bottom 0.152: v11.71,5.74 11.71,5.82 13.65,7.76 13.65,12.79 14.53,13.66 14.53,15.24 | 13.65,17.69 13.65,17.13 14.53,16.26 14.53,15.24 | v12.34,15.15 12.44,15.24 14.53,15.24
SPI1_MISO/ADC_IN6  (via drill 0.3)
  Top 0.152: v12.47,5.8 12.47,5.59 12.68,5.38 U1.16
  Bottom 0.152: SV2.5 16.19,14.9 13.96,12.66 13.96,7.3 12.47,5.81 v12.47,5.8
SPI1_MOSI/ADC_IN7  (via drill 0.3)
  Top 0.152: v13.24,5.79 13.18,5.73 U1.17
  Bottom 0.152: SV2.6 18.73,17.01 14.26,12.54 14.26,7.18 13.37,6.29 13.37,5.91 v13.24,5.79
SWCLK  (via drill 0.3)
  Top 0.152: v17.08,11.8 16.69,11.8 U1.37
  Bottom 0.152: SV1.5 16.19,1.25 14.62,2.83 14.62,10.33 16.09,11.8 v17.08,11.8
SWDIO  (via drill 0.3)
  Top 0.152: v18.38,9.79 18.11,10.06 U1.34
  Bottom 0.152: SV1.7 21.27,6.12 20.95,6.45 20.52,6.45 18.38,8.59 v18.38,9.79
TIM2_CH1/SPI1_NSS/UART1_TX  (via drill 0.3)
  Top 0.152: U3.1 19.44,10.08 19.19,10.34 v19.19,10.96 | v17.15,12.57 16.38,12.57 16.18,12.37 U1.38
  Bottom 0.152: v19.19,10.96 v19.18,10.96 19.18,11.29 17.9,12.57 v17.15,12.57
TIM2_CH1/SPI1_NSS/UART1_TX_TRANS  (via drill 0.3)  (1 unrouted)
  Top 0.152: U3.20 v18.16,11.58 v18.15,11.57 | v20.73,5.92 20.73,5.88 21.53,5.08 26.26,5.08
  Bottom 0.152: v18.15,11.57 17.84,11.26 17.84,8.7 20.62,5.92 v20.73,5.92
TIM2_CH2/SPI1_SCK/UART1_RX  (via drill 0.3)
  Top 0.152: U3.3 20.44,8.86 20.01,8.43 v19.74,8.43 | v15.88,12.85 15.68,12.66 U1.39
  Bottom 0.152: v19.74,8.43 19.72,8.45 19.72,11.19 17.8,13.1 16.13,13.1 v15.88,12.85
TIM2_CH2/SPI1_SCK/UART1_RX_TRANS  (via drill 0.3)  (1 unrouted)
  Top 0.152: U3.18 20.44,12.79 19.94,13.29 v19.66,13.29
  Bottom 0.152: 25.05,7.62 26.26,7.62 | SV3.3 25.08,7.62 19.66,13.04 v19.66,13.29
TIM3_CH1/SPI1_MISO  (via drill 0.3)
  Top 0.152: U3.4 20.94,8.61 v20.61,8.28 | v16.19,13.64 15.91,13.64 15.18,12.91 U1.40
  Bottom 0.152: v16.19,13.64 17.7,13.64 20.02,11.32 20.02,9.71 20.61,9.12 v20.61,8.28
TIM3_CH1/SPI1_MISO_TRANS  (via drill 0.3)  (1 unrouted)
  Top 0.152: U3.17 20.94,12.79 v19.68,14.05
  Bottom 0.152: v19.68,14.05 23.57,10.16 26.26,10.16
TIM3_CH2/SPI1_MOSI  (via drill 0.3)
  Top 0.152: U3.5 21.44,8.35 v21.37,8.28 | v16.8,14.17 15.71,14.17 14.68,13.15 U1.41
  Bottom 0.152: v21.37,8.28 21.37,8.8 20.33,9.84 20.33,11.44 17.6,14.17 v16.8,14.17
TIM3_CH2/SPI1_MOSI_TRANS  (via drill 0.3)  (1 unrouted)
  Top 0.152: v20.1,15.6 20.1,15 20.11,15 21.25,13.85 21.25,13.6 21.44,13.41 U3.16
  Bottom 0.152: v20.1,15.6 20.1,15 21.25,13.85 21.25,13.6 22.31,12.54 23.86,12.54 24.02,12.7 26.26,12.7
TIM5_CH1/ADC1_IN0  (via drill 0.3)  (1 unrouted)
  Top 0.152: U1.10 11.34,6.56 11.44,6.65 15.49,6.65 v15.69,6.45 | v18.37,4.71 23.81,4.71 25.98,2.54 26.26,2.54
  Bottom 0.152: v15.69,6.45 17.43,4.71 v18.37,4.71
TIM5_CH2/ADC1_IN1  (via drill 0.3)  (1 unrouted)
  Top 0.152: U1.11 10.44,6.07 11.29,6.07 11.56,6.35 14.71,6.35 v15.21,5.84 | v18.37,5.47 19.53,5.47 20.51,6.45 22.07,6.45 24.6,8.98 24.6,13.26 25.4,14.06 25.4,14.61 26.03,15.24 26.26,15.24
  Bottom 0.152: v15.21,5.84 15.21,6 14.96,6.26 14.96,6.7 15.27,7.01 15.93,7.01 17.47,5.47 v18.37,5.47
UART6_RX/USB_DP/CAN1_TX
  Top 0.152: U3.6 21.94,8.05 21.64,7.75 19.66,7.75 17.85,9.56 U1.33
UART6_RX/USB_DP/CAN1_TX_TRANS  (via drill 0.3)  (1 unrouted)
  Top 0.152: U3.15 21.94,13.17 21.79,13.33 v21.79,13.82
  Bottom 0.152: v21.79,13.82 22.76,12.84 23.73,12.84 24.04,13.16 24.04,15.84 23.81,16.08 23.81,17.69
UART6_TX/USB_DM/CAN1_RX
  Top 0.152: U3.7 22.44,8.12 21.77,7.44 19.53,7.44 17.92,9.06 U1.32
UART6_TX/USB_DM/CAN1_RX_TRANS  (1 unrouted)
  Top 0.152: U3.14 22.44,13.1 22.34,13.21 22.34,14.02 22.01,14.35 21.56,14.35 21.27,14.64 21.27,17.69

### Text on the board
bNames: www.flyfocus.pl | V1.0